# Altium schematic sheet capacitors.SchDoc
size A4; SheetNumber: 4; SheetTotal: 6
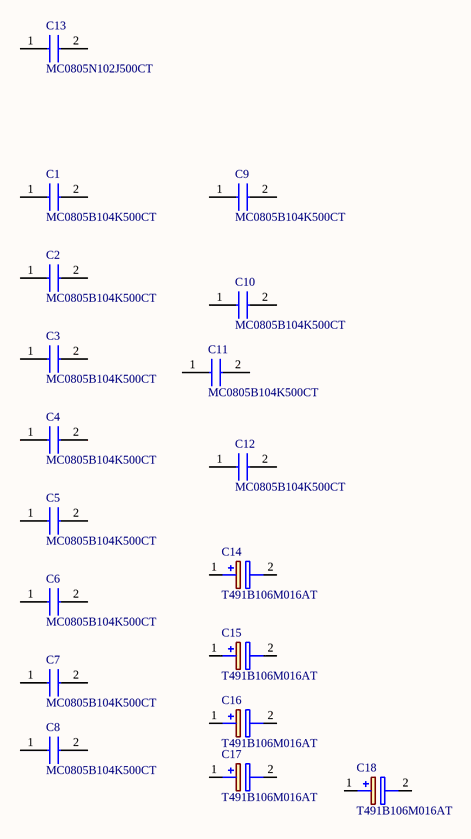
[diagram p0: capacitors.SchDoc]

## Parts
C1  MC0805B104K500CT  [CAPC2012X90N]
C2  MC0805B104K500CT  [CAPC2012X90N]
C3  MC0805B104K500CT  [CAPC2012X90N]
C4  MC0805B104K500CT  [CAPC2012X90N]
C5  MC0805B104K500CT  [CAPC2012X90N]
C6  MC0805B104K500CT  [CAPC2012X90N]
C7  MC0805B104K500CT  [CAPC2012X90N]
C8  MC0805B104K500CT  [CAPC2012X90N]
C9  MC0805B104K500CT  [CAPC2012X90N]
C10  MC0805B104K500CT  [CAPC2012X90N]
C11  MC0805B104K500CT  [CAPC2012X90N]
C12  MC0805B104K500CT  [CAPC2012X90N]
C13  MC0805N102J500CT  [CAPC2012X90N]
C14  T491B106M016AT  [CAPPM3528X210N]
C15  T491B106M016AT  [CAPPM3528X210N]
C16  T491B106M016AT  [CAPPM3528X210N]
C17  T491B106M016AT  [CAPPM3528X210N]
C18  T491B106M016AT  [CAPPM3528X210N]

## Nets

Not connected (* = marked no-connect by the designer): C1 1 2; C2 1 2; C3 1 2; C4 1 2; C5 1 2; C6 1 2; C7 1 2; C8 1 2; C9 1 2; C10 1 2; C11 1 2; C12 1 2; C13 1 2; C14 1(+) 2(-); C15 1(+) 2(-); C16 1(+) 2(-); C17 1(+) 2(-); C18 1(+) 2(-)

## Library data of the parts
C1-C12 = MC0805B104K500CT: Capacitor; Manufacturer_Name: MULTICOMP; Datasheet Link: https://componentsearchengine.com/Datasheets/2/MC0805B104K500CT.pdf; Height: 0.9mm; Manufacturer_Part_Number: MC0805B104K500CT
C13 = MC0805N102J500CT: Capacitor; Manufacturer_Name: MULTICOMP; Datasheet Link: http://www.farnell.com/datasheets/1901289.pdf; Height: 0.9mm; Manufacturer_Part_Number: MC0805N102J500CT
C14-C18 = T491B106M016AT: Capacitor Polarised; Manufacturer_Name: Kemet; Datasheet Link: https://componentsearchengine.com/Datasheets/2/T491B106M016AT.pdf; Height: 2.1mm; Manufacturer_Part_Number: T491B106M016AT; Mouser Part Number: 80-T491B106M016; Mouser Price/Stock: https://www.mouser.co.uk/ProductDetail/KEMET/T491B106M016AT?qs=WydH9nGI6cAnkEyQJLjSzA%3D%3D; Arrow Part Number: T491B106M016AT; Arrow Price/Stock: https://www.arrow.com/en/products/t491b106m016at/kemet-corporation